# EAGLE design adcBreakout (EAGLE 9.6.2)
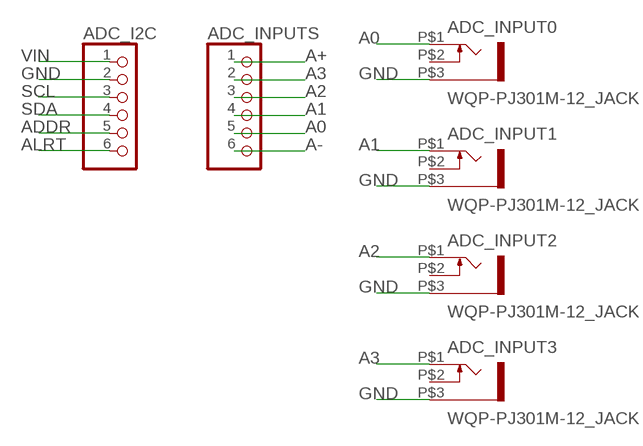
[diagram p0: schematic, sheet 1]

## Parts
ADC_I2C  PINHD-1X6B  [1X06-BIG]
ADC_INPUT0  WQP-PJ301M-12_JACK  [WQP-PJ301M-12_JACK]
ADC_INPUT1  WQP-PJ301M-12_JACK  [WQP-PJ301M-12_JACK]
ADC_INPUT2  WQP-PJ301M-12_JACK  [WQP-PJ301M-12_JACK]
ADC_INPUT3  WQP-PJ301M-12_JACK  [WQP-PJ301M-12_JACK]
ADC_INPUTS  PINHD-1X6B  [1X06-BIG]

## Nets
A0: ADC_INPUT0.P$1 ADC_INPUTS.5
A1: ADC_INPUT1.P$1 ADC_INPUTS.4
A2: ADC_INPUT2.P$1 ADC_INPUTS.3
A3: ADC_INPUT3.P$1 ADC_INPUTS.2
A+: ADC_INPUTS.1
A-: ADC_INPUTS.6
ADDR: ADC_I2C.5
ALRT: ADC_I2C.6
GND: ADC_I2C.2 ADC_INPUT0.P$3 ADC_INPUT1.P$3 ADC_INPUT2.P$3 ADC_INPUT3.P$3
SCL: ADC_I2C.3
SDA: ADC_I2C.4
VIN: ADC_I2C.1
Unconnected: ADC_INPUT0.P$2 ADC_INPUT1.P$2 ADC_INPUT2.P$2 ADC_INPUT3.P$2

## Library data of the parts
ADC_I2C ADC_INPUTS = adafruit:PINHD-1X6: PIN HEADER
ADC_INPUT0 ADC_INPUT1-ADC_INPUT3 = thonkiconn:WQP-PJ301M-12_JACK

## Net classes
1 highpower: width 0.305 mm, drill 0.483 mm

## Board
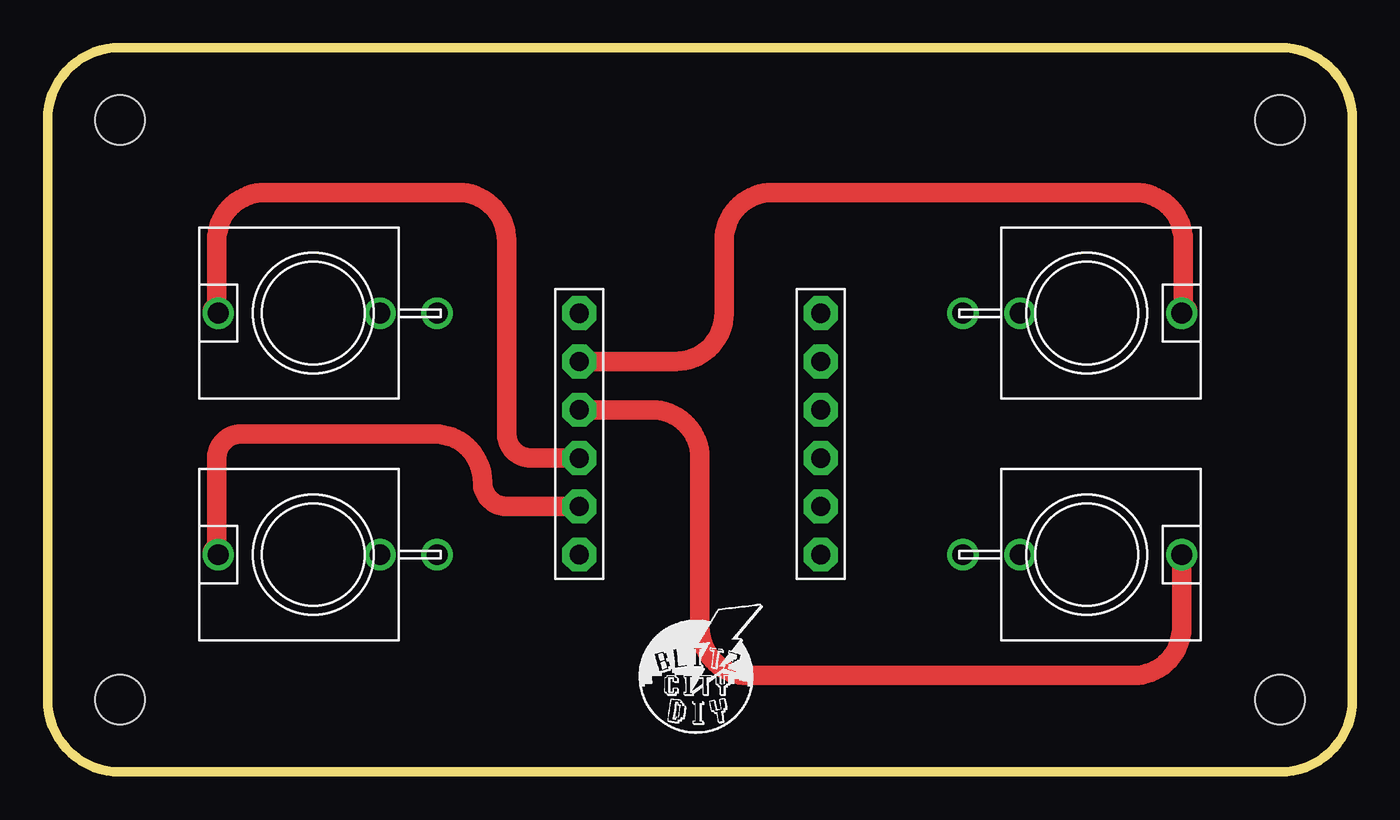
[diagram p1: board, top side]
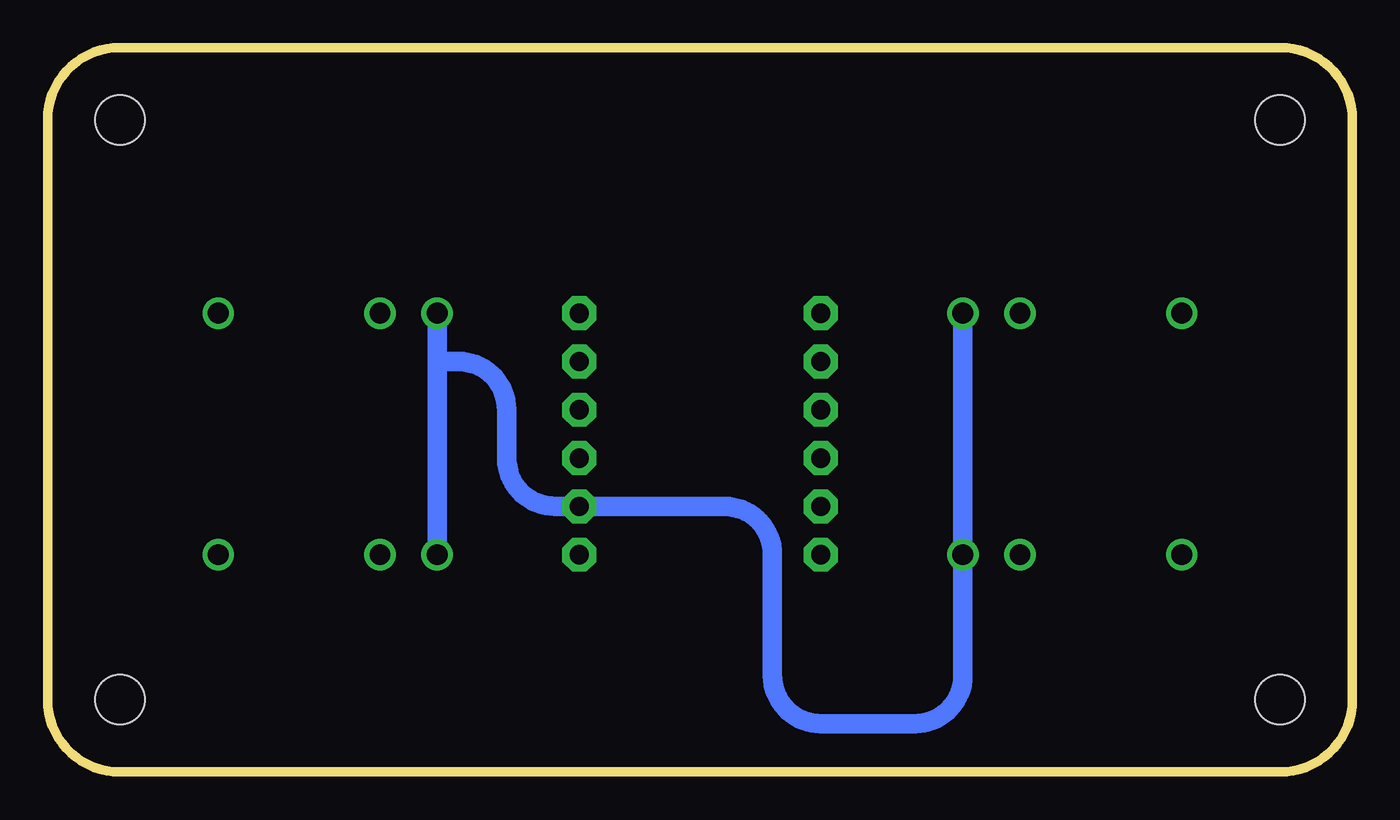
[diagram p2: board, bottom side, seen from below]

Size 68.58 x 38.1 mm. Coordinates in mm from the lower left corner, seen from the top.
Outline: 3.81,38.1 arc90 0,34.29 0,3.81 arc90 3.81,0 64.77,0 arc90 68.58,3.81 68.58,34.29 arc90 64.77,38.1 3.81,38.1
Copper layers (1*16): Top 0.035mm / dielectric 1.5mm / Bottom 0.035mm
Design rules "default": minimum track width 6mil, minimum drill 0.35mm, track to track 6mil, track to pad 6mil, pad to pad 6mil, via to via 6mil, smd to smd 6mil, copper to edge 40mil, drill to drill 6mil, minimum pad ring 10mil, minimum via ring 8mil, stop-mask expansion 4mil, vias tented up to drill 0mil, thermal gap 10mil
Holes 2.6 mm at 3.81,3.81 64.77,3.81 64.77,34.29 3.81,34.29

### Footprints (pad centres in the part's own frame; a part is rotated, then mirrored left to right if it is on the bottom)
1X06-BIG = drill 1.016 pad 1.778 octagon: 1 -6.35,0; 2 -3.81,0; 3 -1.27,0; 4 1.27,0; 5 3.81,0; 6 6.35,0
WQP-PJ301M-12_JACK = drill 1.1: P$1 0,5; P$2 0,-3.5; P$3 0,-6.5

### Placement (x,y rotation side)
ADC_I2C  40.64,17.78 90 top
ADC_INPUT0  54.61,24.13 270 top
ADC_INPUT1  54.61,11.43 270 top
ADC_INPUT2  13.97,24.13 90 top
ADC_INPUT3  13.97,11.43 90 top
ADC_INPUTS  27.94,17.78 90 top
PLABEL0  [PLABEL0]  62.23,20.32 90 top
PLABEL1  [PLABEL1]  62.23,7.62 90 top
PLABEL2  [PLABEL2]  7.62,20.32 90 top
PLABEL3  [PLABEL3]  7.62,7.62 90 top
PLABEL4  [PLABEL4]  39.16,10.16 90 top
PLABEL5  [PLABEL5]  30.76,10.16 90 top
PLABEL6  [PLABEL6]  34.29,31.75 0 top
PLABEL7  [PLABEL7]  57.76,19.05 0 bottom
PLABEL8  [PLABEL8]  34.06,6.35 0 bottom

### Tracks (layer width: path | path; a pad name or v marks a point on that pad's centre or on a via)
A0
  Top 1.016: ADC_INPUTS.5 33.02,21.59 arc90 35.56,24.13 35.56,27.94 arc-90 38.1,30.48 57.15,30.48 arc-90 59.69,27.94 59.69,24.21 arc-90 ADC_INPUT0.P$1
  Top 1.5: 59.69,24.21 arc-90 ADC_INPUT0.P$1
A1
  Top 1.016: ADC_INPUTS.4 31.75,19.05 arc-90 34.29,16.51 34.29,7.62 arc90 36.83,5.08 57.07,5.08 arc90 59.61,7.62 ADC_INPUT1.P$1
A2
  Top 1.016: ADC_INPUTS.3 25.4,16.51 arc-90 24.13,17.78 24.13,27.94 arc90 21.59,30.48 11.43,30.48 arc90 8.89,27.94 8.89,24.21 arc90 ADC_INPUT2.P$1
  Top 1.5: ADC_INPUT2.P$1 arc-90 8.89,24.21
A3
  Top 1.016: ADC_INPUTS.2 24.13,13.97 arc-90 22.86,15.24 arc90 20.32,17.78 10.16,17.78 arc90 8.89,16.51 8.89,11.51 arc90 ADC_INPUT3.P$1
  Top 1.5: 8.89,11.51 arc90 ADC_INPUT3.P$1
GND
  Bottom 1.016: ADC_INPUT0.P$3 48.11,21.59 | 48.11,21.59 ADC_INPUT1.P$3 | 48.11,21.59 46.99,21.59 arc90 44.45,19.05 44.45,16.51 arc-90 41.91,13.97 ADC_I2C.2 33.02,13.97 arc90 30.48,11.43 30.48,5.08 arc-90 27.94,2.54 26.67,2.54 23.01,2.54 arc-90 20.47,5.08 ADC_INPUT3.P$3 ADC_INPUT2.P$3

### Text on the board
Pinguin_tBackup: Modular / Melody / Maker / ADC Breakout | INPUT 2 | ADC INPUTS | INPUT 0 | ADC I2C | INPUT 3 | INPUT 1
Pinguin_bBackup: 🎶🎛🎹 | VERSION 0 / December 2022